# Altium schematic sheet transmitter.SchDoc: 13.56MHz AM-transmitter
size A4; Engineer: CT; SheetNumber: 2; SheetTotal: 4
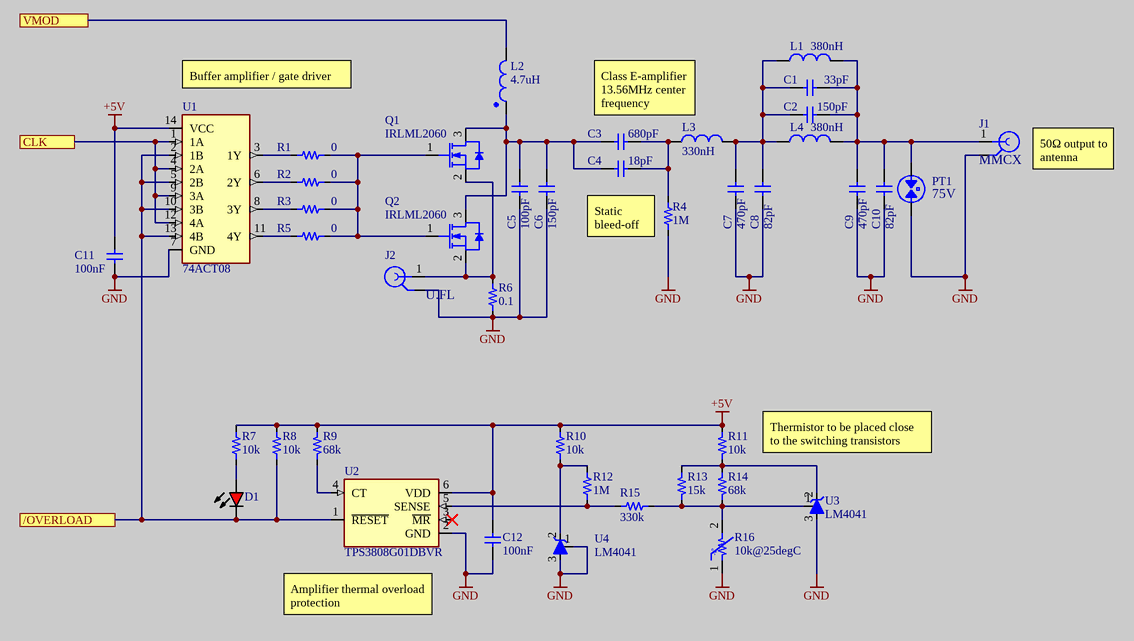
[diagram p0: transmitter.SchDoc]

## Parts
C1  value 33pF  [1206-C-L]  (hidden comment: Capacitor 33pF +/-5% 50V NP0 1206)
C2  value 150pF  [1206-C-N]  (hidden comment: Capacitor 150pF +/-5% 100V NP0 1206)
C3  value 680pF  [1206-C-L]  (hidden comment: Capacitor 680pF +/-5% 100V NP0 1206)
C4  value 18pF  [1206-C-N]  (hidden comment: CC1206JKNPOCBN180)
C5  value 100pF  [1206-C-N]  (hidden comment: Capacitor 100pF +/-5% 630V NP0 Class I 1206)
C6  value 150pF  [1206-C-N]  (hidden comment: Capacitor 150pF +/-5% 100V NP0 1206)
C7  value 470pF  [1206-C-L]  (hidden comment: Capacitor 470pF +/-5% 100V NP0 1206)
C8  value 82pF  [1206-C-N]  (hidden comment: 1206N820J102CT)
C9  value 470pF  [1206-C-L]  (hidden comment: Capacitor 470pF +/-5% 100V NP0 1206)
C10  value 82pF  [1206-C-N]  (hidden comment: 1206N820J102CT)
C11  value 100nF  [0603-C-N]  (hidden comment: Capacitor 100nF +/-10% 50V X7R 0603)
C12  value 100nF  [0603-C-N]  (hidden comment: Capacitor 100nF +/-10% 50V X7R 0603)
D1  150060RS86000  [WL-SMCW_0603_150060xx8x000]  (value not drawn)
J1  66011002111501  [66011002111501]  (value not drawn)
J2  U.FL-R-SMT(10)  [HRS-U.FL-R-SMT_V]  (value not drawn)
L1  Inductance: 380nH  [WE-CAIR_5910]  (hidden comment: 744918238)
L2  Inductance: 4.7uH  [WE-PDA_1260]  (hidden comment: 784771047)
L3  value 330nH  [IND_2929SQ-331]  (hidden comment: 2929SQ-331GEC)
L4  Inductance: 380nH  [WE-CAIR_5910]  (hidden comment: 744918238)
PT1  GTCC23-750M-R01-2  [GDT_4532]  (value not drawn)
Q1  value IRLML2060  [SOT-23-3-N]  (hidden comment: IRLML2060TRPBF)
Q2  value IRLML2060  [SOT-23-3-N]  (hidden comment: IRLML2060TRPBF)
R1  value 0  [0603-R-N]  (hidden comment: Jumper 0R <50 mOhm 1A 0603)
R2  value 0  [0603-R-N]  (hidden comment: Jumper 0R <50 mOhm 1A 0603)
R3  value 0  [0603-R-N]  (hidden comment: Jumper 0R <50 mOhm 1A 0603)
R4  value 1M  [1206-R-N]  (hidden comment: CRG1206F1M0)
R5  value 0  [0603-R-N]  (hidden comment: Jumper 0R <50 mOhm 1A 0603)
R6  value 0.1  [1206-R-N]  (hidden comment: Resistor 0.1R +/-1% 0.5W 1206)
R7  value 10k  [0603-R-N]  (hidden comment: Resistor 10k +/-1% 50V 0603)
R8  value 10k  [0603-R-N]  (hidden comment: Resistor 10k +/-1% 50V 0603)
R9  value 68k  [0603-R-N]  (hidden comment: Resistor 68k +/-1% 50V 0603)
R10  value 10k  [0603-R-N]  (hidden comment: Resistor 10k +/-1% 50V 0603)
R11  value 10k  [0603-R-N]  (hidden comment: Resistor 10k +/-1% 50V 0603)
R12  value 1M  [0603-R-N]  (hidden comment: Resistor 1M +/-1% 50V 0603)
R13  value 15k  [0603-R-N]  (hidden comment: Resistor 15k +/-1% 50V 0603)
R14  value 68k  [0603-R-N]  (hidden comment: Resistor 68k +/-1% 50V 0603)
R15  value 330k  [0603-R-N]  (hidden comment: Resistor 330k +/-1% 50V 0603)
R16  value 10k@25degC  [0603-R-N]  (hidden comment: NCP18XH103F03RB)
U1  value 74ACT08  [SOIC14-N]  (hidden comment: MC74ACT08DR2G)
U2  TPS3808G01DBVR  [SOT-23-6]
U3  value LM4041  [SOT-23-3-N]  (hidden comment: LM4041DIM3X-ADJ/NOPB)
U4  value LM4041  [SOT-23-3-N]  (hidden comment: LM4041DIM3X-ADJ/NOPB)

## Ports
/OVERLOAD, CLK, VMOD

## Nets
+5V: C11.2 C12.2 R7.2 R8.2 R9.1 R10.2 R11.2 U1.14(VCC) U2.6(VDD)
GND: C5.1 C6.1 C7.1 C8.1 C9.1 C10.1 C11.1 C12.1 J1.2(GND) J2.2(GND) PT1.2 R4.1 R6.2 R16.1 U1.7(GND) U2.2(GND) U3.3(A) U4.1(rEF) U4.3(A)
/OVERLOAD: D1.1(K) R8.1 U1.2(1B) U1.5(2B) U1.10(3B) U1.13(4B) U2.1(~{RESET}) ; port /OVERLOAD
CLK: U1.1(1A) U1.4(2A) U1.9(3A) U1.12(4A) ; port CLK
VMOD: L2.2 ; port VMOD
NetC1_1: C1.1 C2.2 C7.2 C8.2 L1.1 L3.2 L4.1
NetC1_2: C1.2 C2.1 C9.2 C10.2 J1.1(SIG) L1.2 L4.2 PT1.1
NetC3_1: C3.1 C4.1 C5.2 C6.2 L2.1 Q1.3(D) Q2.3(D)
NetC3_2: C3.2 C4.2 L3.1 R4.2
NetD1_2: D1.2(A) R7.1
NetJ2_1: J2.1(SIG) Q1.2(S) Q2.2(S) R6.1
NetQ1_1: Q1.1(G) Q2.1(G) R1.2 R2.2 R3.2 R5.2
NetR1_1: R1.1 U1.3(1Y)
NetR2_1: R2.1 U1.6(2Y)
NetR3_1: R3.1 U1.8(3Y)
NetR5_1: R5.1 U1.11(4Y)
NetR9_2: R9.2 U2.4(CT)
NetR10_1: R10.1 R12.2 U4.2(C)
NetR11_1: R11.1 R13.2 R14.2 U3.2(C)
NetR12_1: R12.1 R15.1 U2.5(SENSE)
NetR13_1: R13.1 R14.1 R15.2 R16.2 U3.1(rEF)

Not connected (* = marked no-connect by the designer): U2 3(~{MR})*

## Notes on the sheet
- (near U1) Buffer amplifier / gate driver
- Class E-amplifier
  13.56MHz center frequency
- (near J1) 50Ω output to antenna
- (near R4) Static bleed-off
- Thermistor to be placed close  to the switching transistors
- (near U2) Amplifier thermal overload protection
- Title
- Sheet Revision:
- Link:
- Size:
- Project:
- Engineer:
- A4
- Date:
- Sheet
- of
- File:
- (in symbol CMP-010-00032-14) -t°

## Library data of the parts
C1 = CMP-072-000282-14: WCAP-CSGP Multilayer Ceramic Chip Capacitor, General Purpose, size 1206, NP0, 33pF, 50VDC; Insulation Resistance: 10GO; Q Factor: 1000; Tolerance: 5%; Technical Reference: NP01206330J050DFCT10000; Capacitor Type: MLCC; Pins: 2; Length: 3.2mm; Usage: General Purpose; ComponentLink2Description: Datasheet Link; ComponentLink2URL: https://www.we-online.com/redexpert/spec/885012008040?ad; Design Item ID: 885012008040; Match Code: WCAP-CSGP; Width: 1.6mm; Max Operating Temperature: 125°C; Packaging: Tape and Reel; Voltage Rating: 50V; Min Operating Temperature: -55°C; Mounting Technology: SMT; Height: 0.8mm; Dielectric: NP0; Source: WCAP-CSGP.SchLib; Case/Package: 1206; ComponentLink1Description: Website Link; ComponentLink1URL: https://www.we-online.com/redexpert/article/885012008040?ad; JLCPCB Part #: C571053
C2 C6 = CMP-072-000302-14: WCAP-CSGP Multilayer Ceramic Chip Capacitor, General Purpose, size 1206, NP0, 150pF, 100VDC; Q Factor: 1000; Insulation Resistance: 10GO; Capacitor Type: MLCC; Tolerance: 5%; Technical Reference: NP01206151J100DFCT10000; Packaging: Tape and Reel; Dielectric: NP0; Voltage Rating: 100V; Min Operating Temperature: -55°C; ComponentLink1URL: https://www.we-online.com/redexpert/article/885012008068?ad; Length: 3.2mm; Source: WCAP-CSGP.SchLib; ComponentLink1Description: Website Link; Design Item ID: 885012008068; Mounting Technology: SMT; Pins: 2; Max Operating Temperature: 125°C; JLCPCB Part #: C162445; Height: 0.8mm; Usage: General Purpose; ComponentLink2Description: Datasheet Link; Width: 1.6mm; ComponentLink2URL: https://www.we-online.com/redexpert/spec/885012008068?ad; Match Code: WCAP-CSGP; Case/Package: 1206
C3 = CMP-072-000305-14: WCAP-CSGP Multilayer Ceramic Chip Capacitor, General Purpose, size 1206, NP0, 680pF, 100VDC; Technical Reference: NP01206681J100DFCT10000; Tolerance: 5%; Insulation Resistance: 10GO; Capacitor Type: MLCC; Q Factor: 1000; Mounting Technology: SMT; Case/Package: 1206; Min Operating Temperature: -55°C; Packaging: Tape and Reel; ComponentLink1URL: https://www.we-online.com/redexpert/article/885012008072?ad; ComponentLink1Description: Website Link; Pins: 2; ComponentLink2Description: Datasheet Link; Max Operating Temperature: 125°C; Width: 1.6mm; Design Item ID: 885012008072; Source: WCAP-CSGP.SchLib; Height: 0.8mm; Match Code: WCAP-CSGP; Usage: General Purpose; Voltage Rating: 100V; Dielectric: NP0; Length: 3.2mm; ComponentLink2URL: https://www.we-online.com/redexpert/spec/885012008072?ad; JLCPCB Part #: C541497
C4 = CMP-001-00140-2: Surface Mount Ceramic Multilayer Capacitor 18pF 5% C0G 1kV 1206 Blister T/R; RoHS Compliant: Yes; Min Operating Temperature: -55°C; Width: 0.063inch; Tolerance: 5%; Max Operating Temperature: 125°C; Case/Package: 1206; Thickness: 0.057inch; Voltage Rating: 1kV; Series: CC; Packaging: Tape and Reel; JLCPCB Part #: C33039; Mounting Technology: Surface Mount; Length: 0.126inch
C5 = CMP-082-000014-11: WCAP-CSMH Multilayer Ceramic Chip Capacitor, Mid and High Voltage, 1206, NP0 Class I, 100pF, 630VDC; Capacitor Type: MLCC; Q Factor: 1000; Tolerance: 5%; Technical Reference: NP01206101J630DFCT10000; Insulation Resistance: 10GOhm; Max Operating Temperature: 125°C; JLCPCB Part #: C9188; Match Code: WCAP-CSMH; Usage: Mid and High Voltage; ComponentLink1URL: https://www.we-online.com/redexpert/article/885342008004?ad; ComponentLink2URL: https://www.we-online.com/redexpert/spec/885342008004?ad; Voltage Rating: 630V; Width: 1.6mm; Pins: 2; ComponentLink2Description: Datasheet; Case/Package: 1206; Design Item ID: 885342008004; ComponentLink1Description: Manufacturer Link; Dielectric: NP0 Class I; Height: 0.8mm; Packaging: Tape and Reel; Mounting Technology: SMT; Length: 3.2mm; Min Operating Temperature: -55°C; Source: WCAP-CSMH.SchLib
C7 C9 = CMP-072-000304-14: WCAP-CSGP Multilayer Ceramic Chip Capacitor, General Purpose, size 1206, NP0, 470pF, 100VDC; Q Factor: 1000; Capacitor Type: MLCC; Insulation Resistance: 10GO; Tolerance: 5%; Technical Reference: NP01206471J100DFCT10000; Usage: General Purpose; Design Item ID: 885012008071; ComponentLink1Description: Website Link; Min Operating Temperature: -55°C; Length: 3.2mm; Mounting Technology: SMT; Width: 1.6mm; Case/Package: 1206; Source: WCAP-CSGP.SchLib; Packaging: Tape and Reel; ComponentLink2URL: https://www.we-online.com/redexpert/spec/885012008071?ad; ComponentLink2Description: Datasheet Link; Max Operating Temperature: 125°C; Pins: 2; Height: 0.8mm; Voltage Rating: 100V; ComponentLink1URL: https://www.we-online.com/redexpert/article/885012008071?ad; Dielectric: NP0; Match Code: WCAP-CSGP; JLCPCB Part #: C107177
C8 C10 = CMP-001-00141-1: Cap Ceramic 82pF 1000V C0G 5% Pad SMD 1206 125C T/R; Voltage Rating (DC): 1kV; Case Code (Metric): 3216; Case/Package: 1206; RoHS Compliant: Yes; JLCPCB Part #: C396810; Lead Free: Lead Free
C11 C12 = CMP-072-000619-14: WCAP-CSGP Multilayer Ceramic Chip Capacitor, General Purpose, size 0603, X7R, 100nF, 50VDC; Dissipation Factor: 3%; Tolerance: 10%; Capacitor Type: MLCC; Insulation Resistance: 5GO; Technical Reference: X7R0603104K050DFCT10000; ComponentLink2Description: Datasheet Link; Dielectric: X7R; ComponentLink2URL: https://www.we-online.com/redexpert/spec/885012206095?ad; Case/Package: 0603; Voltage Rating: 50V; Height: 0.8mm; JLCPCB Part #: C14663; Design Item ID: 885012206095; Pins: 2; Min Operating Temperature: -55°C; Max Operating Temperature: 125°C; Width: 0.8mm; ComponentLink1URL: https://www.we-online.com/redexpert/article/885012206095?ad; Match Code: WCAP-CSGP; Packaging: Tape and Reel; Source: WCAP-CSGP.SchLib; Usage: General Purpose; Length: 1.6mm; ComponentLink1Description: Website Link; Mounting Technology: SMT
D1 = CMP-002-001080-9: WL-SMCW Mono-color Chip LED Waterclear, size 0603, Red, 2V, 60°; Manufacturer: Wurth Elektronik; Case/Size Code: 0603; Dominant Wavelength: 624nm; Peak Wavelength: 632nm; Luminous Intensity: 800mcd; Chip Technology: AlInGaP; Match Code: WL-SMCW; Source: WL-SMCW.SchLib; Length: 1.6mm; Height: 0.95mm; Emitting Color: Red; Forward Voltage: 2V; ComponentLink1URL: https://www.we-online.com/redexpert/article/150060RS86000?ad; Operating Temperature Min: -40°C; Mount: Surface Mount; Pin Count: 2; Design Item ID: 150060RS86000; ComponentLink1Description: Website Link; Packaging: Tape and Reel; ComponentLink2URL: https://www.we-online.com/redexpert/spec/150060RS86000?ad; JLCPCB Part #: C5875741; Operating Temperature Max: 85°C; Manufacturer Part Number: 150060RS86000; ComponentLink2Description: Datasheet Link; Viewing Angle: 60°; Category: Signal LEDs; Component Type: Standard; Width: 0.8mm
J1 = CMP-002-000609-5: WR-MMCX PCB Jack, THT, Right Angle, 6GHz, 50O; pin to pad: 2>2+3+4+5; Manufacturer: Wurth Elektronik; Value: MMCX; Center Contact Diameter: 0.7mm; Interface Type: IEC 61169-52; Category: Coaxial Connectors; Component Type: Standard; ComponentLink1Description: Website Link; ComponentLink1URL: https://www.we-online.com/redexpert/article/66011002111501?ad; Pin Count: 5; Impedance: 50O; ComponentLink2Description: Datasheet Link; Design Item ID: 66011002111501; JLCPCB Part #: C2894793; Operating Temperature Max: 155°C; Length: 6.5mm; Manufacturer Part Number: 66011002111501; Gender: Jack; ComponentLink2URL: https://www.we-online.com/redexpert/spec/66011002111501?ad; Packaging: Tray; Operating Temperature Min: -55°C; Height: 3.8mm; Orientation: Right Angle; Connector Type: MMCX; Width: 3.5mm; Frequency Range: 6GHz; Source: WR-MMCX.SchLib; Match Code: WR-MMCX; Mount: Through Hole
J2 = CMP-002-00035-11: Ultra Small Surface Mount Coaxial Connector, 50 Ohm, -40 to 90 degC, 3-Pin SMD, RoHS, Tape and Reel; pin to pad: 1>3 2>1+2; Manufacturer: Hirose Electric; Resistance: 50Ohm; Connector Type: RF&Coax; Value: U.FL; Package Reference: U.FL-R-SMT; Datasheet Version: Aug-16; Package Description: 3-Pin Surface Mount Device, Body 2.6 x 2.6 mm; Fastening Type: Snap; Datasheet URL: https://www.hirose.com/product/en/download_file/key_name/U.FL/category/Catalog/doc_file_id/31697/?file_category_id=4&item_id=15&is_series=1; Manufacturer URL: https://www.hirose.com; Contact Plating: Gold; Max Operating Temperature: 90°C; Package Quantity: 2500; Impedance: 50Ohm; JLCPCB Part #: C88373; Packaging: TapeandReel; Min Operating Temperature: -40°C; Mounting Technology: SM; RoHS Compliant: True; Contact Material: Brass; Case/Package: U.FL-R-SMT
L1 L4 = CMP-165-000056-2: WE-CAIR SMT Air Coil, size 5910, 380nH, 2.5A, 50mO; Manufacturer: Wurth Elektronik; Inductance Tolerance: 5%; Case/Size Code: 5910; Self Resonant Frequency: 0.59GHz; Q Factor: 100; ComponentLink2Description: Datasheet Link; ComponentLink1URL: https://www.we-online.com/redexpert/article/744918238?ad; ComponentLink1Description: Website Link; Operating Temperature Max: 125°C; Source: WE-CAIR.SchLib; Design Item ID: 744918238; Category: RF Inductors; Mount: Surface Mount; Match Code: WE-CAIR; ComponentLink2URL: https://www.we-online.com/redexpert/spec/744918238?ad; Rated Current: 2.5A; Pin Count: 2; Packaging: Tape and Reel; Manufacturer Part Number: 744918238; Operating Temperature Min: -40°C; Width: 6.35mm; Component Type: Standard; JLCPCB Part #: -; Height: 5.9mm; Length: 10.55mm; DC Resistance Max: 50mO
L2 = CMP-163-000034-2: WE-PDA SMT Shielded Power Inductor, size 1260, 4.7uH, 6.2A, 17.5mOhm; Manufacturer: Wurth Elektronik; DC Resistance: 14.5mOhm; Saturation Current: 8A; Case/Size Code: 1260; Self Resonant Frequency: 49.8MHz; Automotive: Yes; Source: WE-PDA.SchLib; Operating Temperature Max: 125°C; Pin Count: 2; Width: 12mm; Operating Temperature Min: -40°C; Height: 6mm; ComponentLink1Description: Website Link; Category: Power Inductors; Component Type: Standard; Packaging: Tape and Reel; ComponentLink1URL: https://www.we-online.com/redexpert/article/784771047?ad; Rated Current: 6.2A; DC Resistance Max: 17.5mOhm; ComponentLink2URL: https://www.we-online.com/redexpert/spec/784771047?ad; Manufacturer Part Number: 784771047; Design Item ID: 784771047; Length: 12mm; ComponentLink2Description: Datasheet Link; Match Code: WE-PDA; Mount: Surface Mount
L3 = CMP-006-00042-1: RF inductor, air core, 2% tol, SMT, RoHS, halogen-free; Current Rating: 4.7A; Inductance Tolerance: 5%; Self Resonant Frequency: 660MHz; Test Frequency: 50MHz; Q Factor: 180; Series: 2929SQ; Tolerance: 2%; JLCPCB Part #: C20623511; RoHS Compliant: Yes; Reach SVHC Compliant: No; Core Material: Air; Case/Package: SMD/SMT; Max Operating Temperature: 125°C; Height: 7.24mm; Max DC Current: 4.7A; Lead Free: Yes; Termination: SMD/SMT; RMS Current (Irms): 4.7A; Min Operating Temperature: -40°C; Packaging: Tape and Reel; Width: 7.24mm; Length: 14.1mm
PT1 = CMP-142-000015-1: Gas Discharge Tubes - GDTs / Gas Plasma Arrestors 75VDC 2-POLE 600V @1KV/US; Fail Short: No; Value: 75V; Tolerance: 20%; Number of Poles: 2; Case Code (Imperial): 1812; Packaging: Cut Tape; JLCPCB Part #: C9234; Case Code (Metric): 4532; Mounting Technology: Surface Mount; Case/Package: 1812; Lead Free: Lead Free; RoHS Compliant: Yes; Series: GT
Q1 Q2 = CMP-142-000014-3: 60V Single N-Channel HEXFET Power MOSFET in a Micro 3 package, SOT23-3, RoHS; Max Power Dissipation: 1.25W; Turn-On Delay Time: 4.9ns; Threshold Voltage: 2.5V; Recovery Time: 21ns; Drain-source On Resistance-Max: 480MR; Gate to Source Voltage (Vgs): 16V; Continuous Drain Current (ID): 1.2A; Turn-Off Delay Time: 3.7ns; Input Capacitance: 64pF; Drain to Source Voltage (Vdss): 60V; Case/Package: SOT-23; Mounting Technology: Surface Mount; Pins: 3; Width: 1.4mm; Reach SVHC Compliant: No; Lead Free: Lead Free; Height: 1.02mm; Length: 3.04mm; Max Operating Temperature: 150°C; RoHS Compliant: Yes; Min Operating Temperature: -55°C; JLCPCB Part #: C67275
R1-R3 R5 = CMP-009-00006-26: Chip Jumper, Thick Film, Jumper, 0603, 100mW, 1A, 0 Ohm, <50 mOhm; FLIR Part #: YRES0E-1; Page Part #: ROQJ0000; Tolerance: 50 mOhm; Voltage Rating: 75V; Elements: 1; Usage: Jumper; Case/Package: 0603; Power Rating: 100mW; Current Rating: 1A; Min Operating Temperature: -55°C; RoHS Compliant: True; Resistor Type: Thick Film; Max Operating Temperature: 155°C; JLCPCB Part #: C21189; Pins: 2; Mounting Technology: SMT
R4 = CMP-009-00382-2: Res Thick Film 1206 1M Ohm 1% 0.25W(1/4W) ±100ppm/C SMD T/R; Number of Resistors: 1; Max Power Dissipation: 250mW; Operating Supply Voltage: 200V; Temperature Coefficient: 100ppm/°C; Min Operating Temperature: -55°C; JLCPCB Part #: C17927; Case Code (Metric): 3216; Case/Package: 1206; Technology: THICK FILM; Case Code (Imperial): 1206; Package Quantity: 5000; Mounting Technology: Surface Mount; Height: 0.55mm; Series: CRG, Neohm; Tolerance: 1%; Number of Terminations: 2; Depth: 1.55mm; Voltage Rating: 200V; Termination: Solder; Weight: 0.000571oz; Width: 1.55mm; Power Rating: 250mW; Resistor Type: Thick Film; Military Standard: Not; Pins: 1206; Packaging: Tape and Reel; RoHS Compliant: Yes; ELV: Compliant; Max Operating Temperature: 125°C; Length: 3.1mm
R6 = CMP-009-00286-9: Res Thick Film 1206 0.1 Ohm 1% 1/2W ±100ppm/°C Molded SMD SMD Paper T/R; FLIR Part #: YRES0E1-3; Max Power Dissipation: 500mW; Usage: General Purpose; Min Operating Temperature: -55°C; Series: CSR; Length: 0.12inch; Contact Plating: Tin,Matte; Case Code (Imperial): 1206; JLCPCB Part #: C346763; Construction: Rectangular; Resistor Type: Thick Film; Depth: 1.55mm; Military Standard: Not; Lead Free: Lead Free; Mounting Technology: Surface Mount; Power Rating: 500mW; Tolerance: 1%; Case Code (Metric): 3216; Temperature Coefficient: 100ppm/°C; Packaging: Tape and Reel; Height: 0.026inch; Number of Terminations: 2; Radiation Hardening: No; RoHS Compliant: Yes; Width: 0.061inch; Case/Package: 1206; Max Operating Temperature: 155°C
R7 R8 R10 R11 = CMP-009-00017-28: Chip Resistor, Thick Film, General Purpose, 0603, 100mW, 50V, 10 kOhm, +/-1%; FLIR Part #: YRES10K-1; Page Part #: ROQF1002; Elements: 1; Tolerance: 1%; Usage: General Purpose; Voltage Rating: 50V; RoHS Compliant: Yes; JLCPCB Part #: C25804; Power Rating: 100mW; Pins: 2; Min Operating Temperature: -55°C; Resistor Type: Thick Film; Case/Package: 0603; Max Operating Temperature: 155°C; Mounting Technology: SMT
R9 R14 = CMP-009-00207-23: Chip Resistor, Thick Film, General Purpose, 0603, 100mW, 50V, 68 kOhm, +/-1%; Page Part #: ROQF6802; Tolerance: 1%; Elements: 1; Usage: General Purpose; Pins: 2; RoHS Compliant: Yes; Power Rating: 100mW; Max Operating Temperature: 155°C; Mounting Technology: SMT; Voltage Rating: 50V; Case/Package: 0603; JLCPCB Part #: C114633; Min Operating Temperature: -55°C; Resistor Type: Thick Film
R12 = CMP-009-00234-17: Chip Resistor, Thick Film, General Purpose, 0603, 100mW, 50V, 1 MOhm, +/-1%; Tolerance: 1%; Elements: 1; RoHS Compliant: Yes; Mounting Technology: SMT; Max Operating Temperature: 155°C; Resistor Type: Thick Film; Usage: General Purpose; Voltage Rating: 50V; Min Operating Temperature: -55°C; Power Rating: 100mW; JLCPCB Part #: C22935; Pins: 2; Case/Package: 0603
R13 = CMP-009-00284-14: Chip Resistor, Thick Film, General Purpose, 0603, 100mW, 50V, 15 kOhm, +/-1%; Page Part #: ROQF1502; Elements: 1; Tolerance: 1%; Temperature Coefficient: 100ppm/°C; Features: Moisture Resistant; JLCPCB Part #: C22809; Voltage Rating: 50V; Pins: 2; Power Rating: 100mW; RoHS Compliant: Yes; Min Operating Temperature: -55°C; Max Operating Temperature: 155°C; Mounting Technology: SMT; Case/Package: 0603; Resistor Type: Thick Film; Usage: General Purpose; Lead Free: Lead Free
R15 = CMP-009-00316-10: Chip Resistor, Thick Film, General Purpose, 0603, 100mW, 50V, 330 kOhm, +/-1%; Tolerance: 1%; Elements: 1; Temperature Coefficient: 100ppm/°C; Min Operating Temperature: -55°C; Max Operating Temperature: 155°C; Pins: 2; Voltage Rating: 50V; JLCPCB Part #: C23137; Usage: General Purpose; Power Rating: 100mW; Resistor Type: Thick Film; Case/Package: 0603; Mounting Technology: SMT
R16 = CMP-010-00032-14: Thermistor NTC 10K Ohm 5% 2-Pin 0603 Surface Mount Solder Pad 3450K T/R; Page Part #: RNTC10KNCP; Tolerance: 1%; Beta Value: 3428k; Min Operating Temperature (MiOT): -40; Case/Package: 0603; Max Operating Temperature (MaOT): 125; JLCPCB Part #: C13564
U1 = CMP-016-00026-2: And Gate 4-ELEMENT 2-IN Cmos Automotive 14-PIN SOIC N T/r / IC Gate And 4CH 2-INP 14-SOIC; JLCPCB Part #: C233452; Logic Function: AND GATE
U2 = CMP-019-00093-4: Supervisor Open Drain or Open Collector 1 Channel SOT-23-6; JLCPCB Part #: C19653
U3 U4 = CMP-019-00107-2: Fixed & adjustable, 45-µA, precision micropower shunt voltage reference 3-SOT-23 -40 to 85; Reference Type: Shunt,Adjustable; Max Output current: 12mA; Number of Channels: 1; Max Output Voltage: 10V; Cathode Current: 70uA; Temperature Coefficient: 150ppm/°C; Tolerance: 1%; Mounting Technology: Surface Mount; Series: LM4041-N; Package Quantity: 3000; Min Operating Temperature: -40°C; Case/Package: SOT-23; RoHS Compliant: Yes; Output Current: 12mA; Packaging: Tape and Reel; JLCPCB Part #: C2156756; Max Operating Temperature: 125°C; Pins: 3; Radiation Hardening: No; Lead Free: Lead Free; Output Voltage: 10V